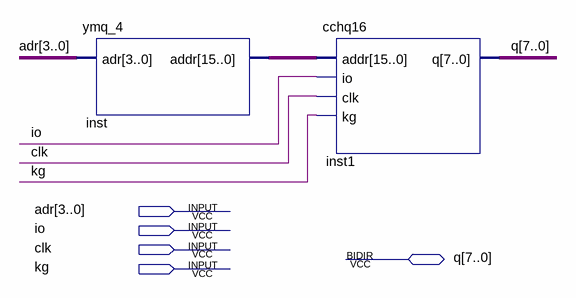
[diagram p0: schematic sheet]
// Quartus schematic cchqk.bdf as structural Verilog: 2 symbols, 5 pins
module cchqk (
  input  [3:0] adr,
  input  io,
  input  clk,
  input  kg,
  inout  [7:0] q
);

  wire [15:0] inst_addr;

  ymq_4 inst (.adr(adr), .addr(inst_addr));
  cchq16 inst1 (.addr(inst_addr), .io(io), .clk(clk), .kg(kg), .q(q));
endmodule
